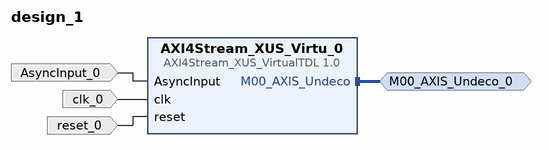
[diagram p0: block diagram of the top level]
# Vivado block design design_1, xcku115-flvb2104-2-e, Vivado 2020.2
create_bd_design design_1

create_bd_intf_port -mode Master -vlnv xilinx.com:interface:axis_rtl:1.0 M00_AXIS_Undeco_0
create_bd_port -dir I -type data AsyncInput_0
create_bd_port -dir I -type clk clk_0
create_bd_port -dir I -type rst reset_0
set_property -dict {CONFIG.POLARITY ACTIVE_HIGH} [get_bd_ports reset_0]

create_bd_cell -type ip -vlnv DigiLAB:ip:AXI4Stream_XUS_VirtualTDL:1.0 AXI4Stream_XUS_Virtu_0

# ---- connections ----

connect_bd_intf_net [get_bd_intf_ports M00_AXIS_Undeco_0] [get_bd_intf_pins AXI4Stream_XUS_Virtu_0/M00_AXIS_Undeco]
connect_bd_net -net AsyncInput_0_1 [get_bd_ports AsyncInput_0] [get_bd_pins AXI4Stream_XUS_Virtu_0/AsyncInput]
connect_bd_net -net clk_0_1 [get_bd_ports clk_0] [get_bd_pins AXI4Stream_XUS_Virtu_0/clk]
connect_bd_net -net reset_0_1 [get_bd_ports reset_0] [get_bd_pins AXI4Stream_XUS_Virtu_0/reset]

validate_bd_design
save_bd_design
